# Altium schematic sheet MCU.SchDoc
size A3; SheetNumber: 4; SheetTotal: 13
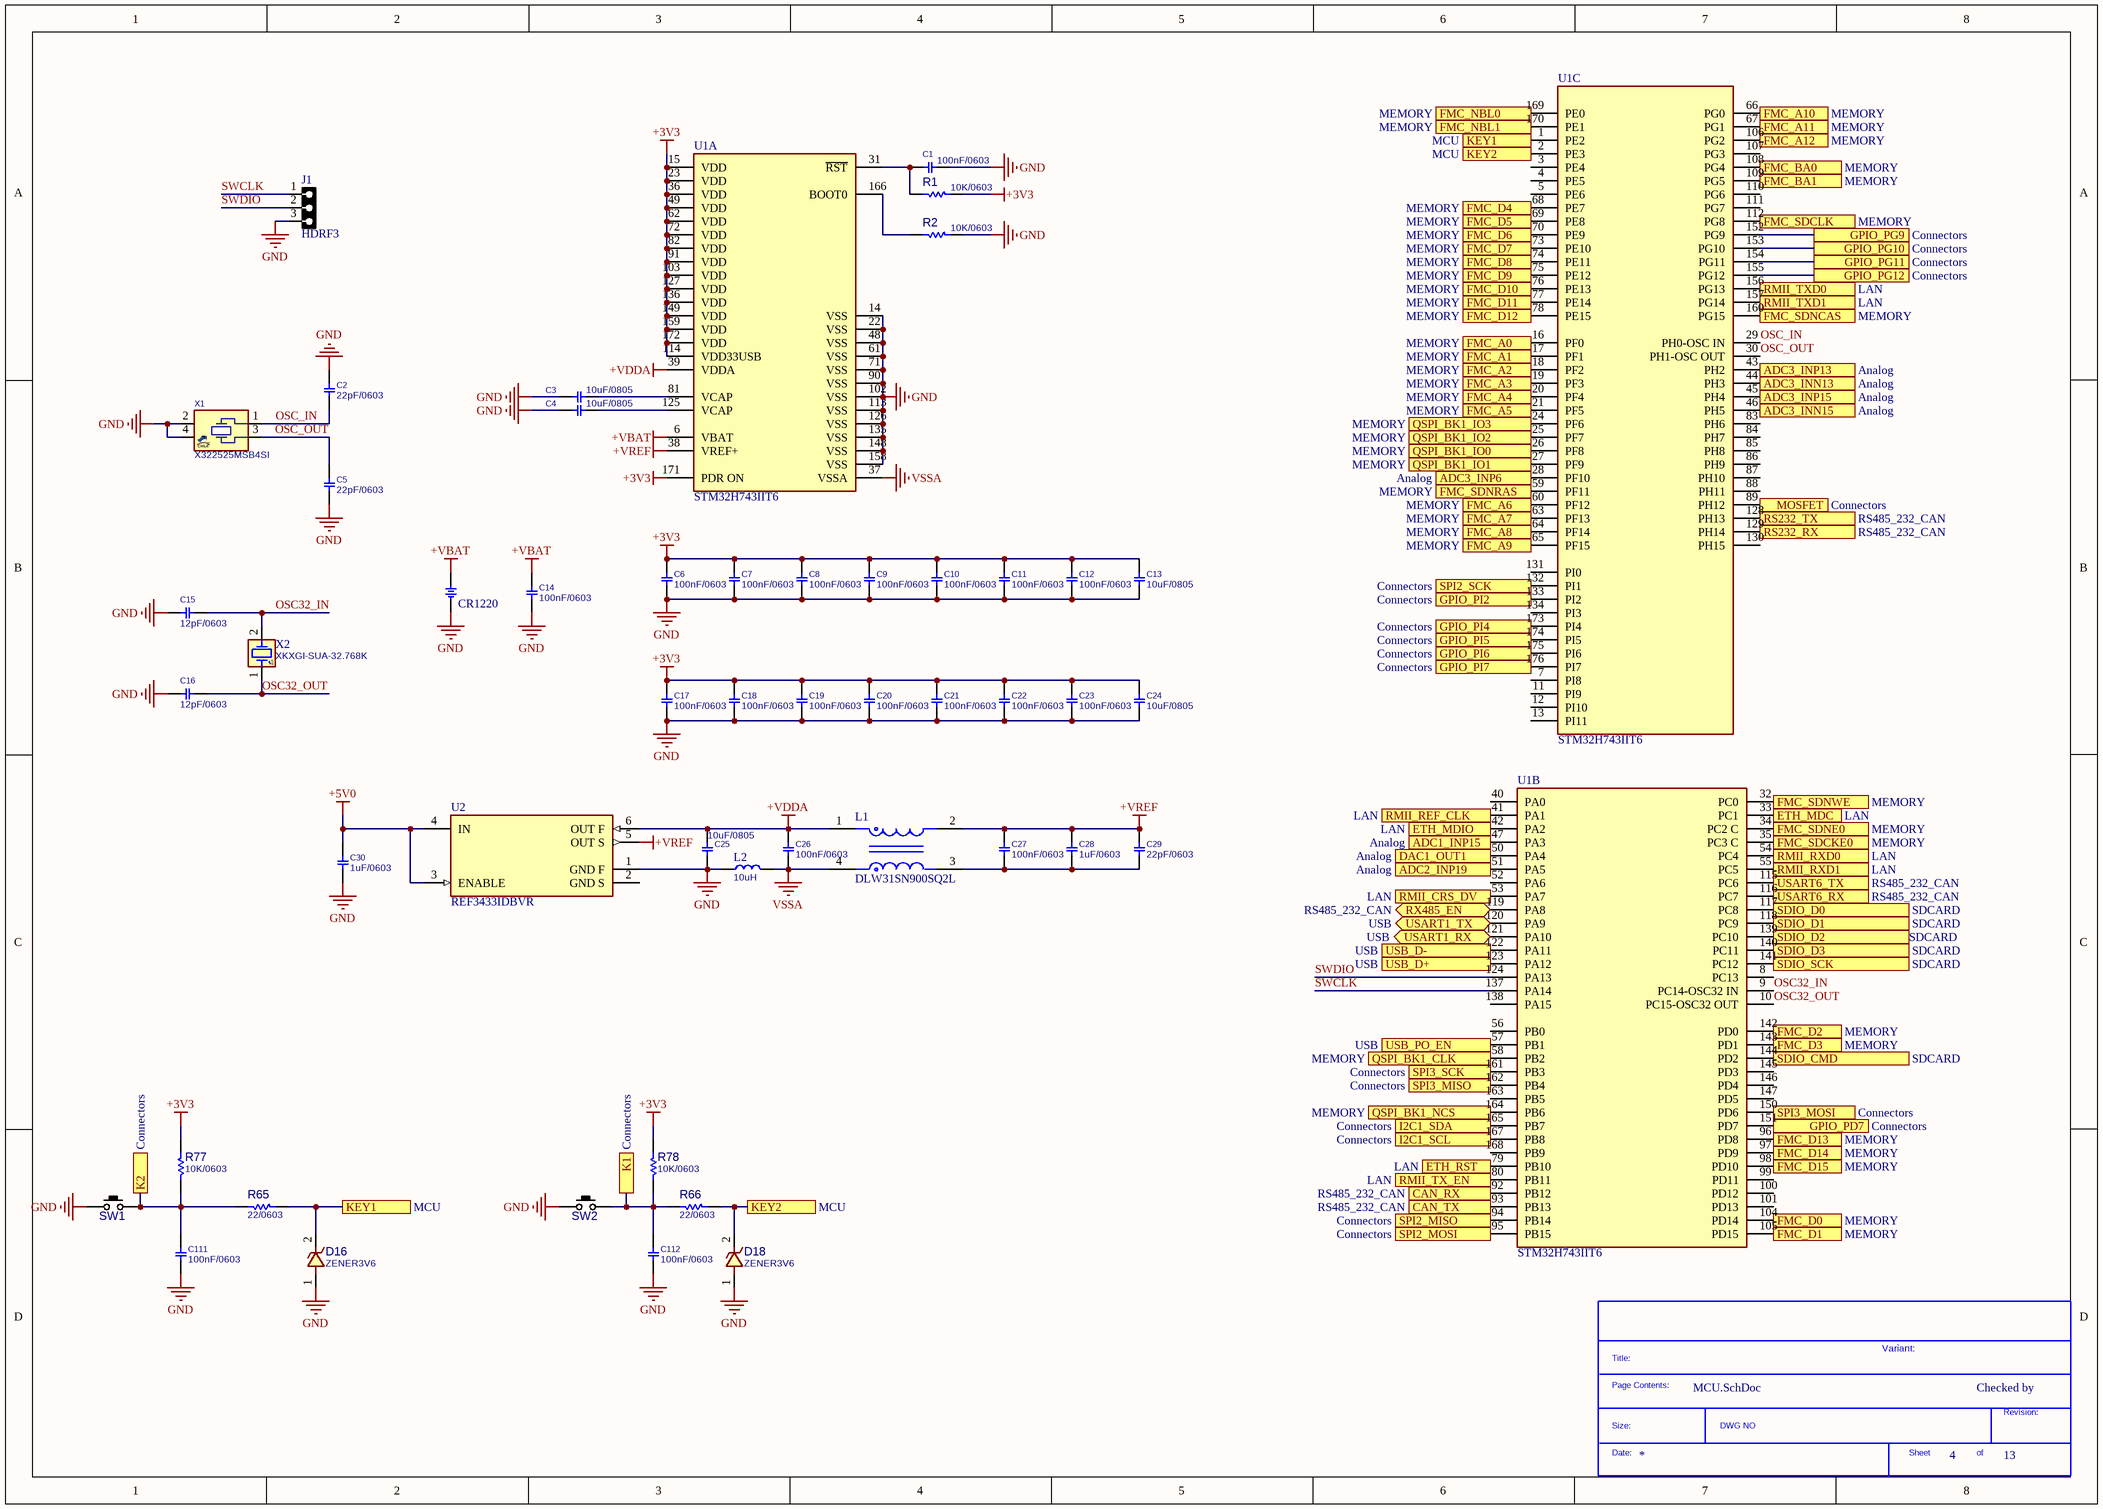
[diagram p0: MCU.SchDoc]

## Parts
?  (no value)  (graphical)
BT1  CR1220  [BTH1220]
C1  100nF/0603  [C0603]
C2  22pF/0603  [C0603]
C3  10uF/0805  [C0805]
C4  10uF/0805  [C0805]
C5  22pF/0603  [C0603]
C6  100nF/0603  [C0603]
C7  100nF/0603  [C0603]
C8  100nF/0603  [C0603]
C9  100nF/0603  [C0603]
C10  100nF/0603  [C0603]
C11  100nF/0603  [C0603]
C12  100nF/0603  [C0603]
C13  10uF/0805  [C0805]
C14  100nF/0603  [C0603]
C15  12pF/0603  [C0603]
C16  12pF/0603  [C0603]
C17  100nF/0603  [C0603]
C18  100nF/0603  [C0603]
C19  100nF/0603  [C0603]
C20  100nF/0603  [C0603]
C21  100nF/0603  [C0603]
C22  100nF/0603  [C0603]
C23  100nF/0603  [C0603]
C24  10uF/0805  [C0805]
C25  10uF/0805  [C0805]
C26  100nF/0603  [C0603]
C27  100nF/0603  [C0603]
C28  1uF/0603  [C0603]
C29  22pF/0603  [C0603]
C30  1uF/0603  [C0603]
C111  100nF/0603  [C0603]
C112  100nF/0603  [C0603]
D16  ZENER3V6  [D_SOD123W]
D18  ZENER3V6  [D_SOD123W]
J1  HDRF3  [HDR_F_1X3]
L1  DLW31SN900SQ2L  [FP-DLW31S-MFG]
L2  10uH  [L0805]
R1  10K/0603  [R0603]
R2  10K/0603  [R0603]
R65  22/0603  [R0603]
R66  22/0603  [R0603]
R77  10K/0603  [R0603]
R78  10K/0603  [R0603]
SW1  PUSHBUTTON  [SWPBS_SPST_6X3X5]  (value not drawn)
SW2  PUSHBUTTON  [SWPBS_SPST_6X3X5]  (value not drawn)
U1  STM32H743IIT6  [FP-LQFP176-1T-IPC_C]  (parts A,B,C of 3)
U2  REF3433IDBVR  [FP-DBV0006A-MFG]
X1  X322525MSB4SI  [XTL_4_3225]
X2  XKXGI-SUA-32.768K  [XTL_2_3215]

## Ports
ADC1_INP15 (see Analog), ADC2_INP19 (see Analog), ADC3_INN13 (see Analog), ADC3_INN15 (see Analog), ADC3_INP6 (see Analog), ADC3_INP13 (see Analog), ADC3_INP15 (see Analog), CAN_RX (see RS485_232_CAN), CAN_TX (see RS485_232_CAN), DAC1_OUT1 (see Analog), ETH_MDC (see LAN), ETH_MDIO (see LAN), ETH_RST (see LAN), FMC_A0 (see MEMORY), FMC_A1 (see MEMORY), FMC_A2 (see MEMORY), FMC_A3 (see MEMORY), FMC_A4 (see MEMORY), FMC_A5 (see MEMORY), FMC_A6 (see MEMORY), FMC_A7 (see MEMORY), FMC_A8 (see MEMORY), FMC_A9 (see MEMORY), FMC_A10 (see MEMORY), FMC_A11 (see MEMORY), FMC_A12 (see MEMORY), FMC_BA0 (see MEMORY), FMC_BA1 (see MEMORY), FMC_D0 (see MEMORY), FMC_D1 (see MEMORY), FMC_D2 (see MEMORY), FMC_D3 (see MEMORY), FMC_D4 (see MEMORY), FMC_D5 (see MEMORY), FMC_D6 (see MEMORY), FMC_D7 (see MEMORY), FMC_D8 (see MEMORY), FMC_D9 (see MEMORY), FMC_D10 (see MEMORY), FMC_D11 (see MEMORY), FMC_D12 (see MEMORY), FMC_D13 (see MEMORY), FMC_D14 (see MEMORY), FMC_D15 (see MEMORY), FMC_NBL0 (see MEMORY), FMC_NBL1 (see MEMORY), FMC_SDCKE0 (see MEMORY), FMC_SDCLK (see MEMORY), FMC_SDNCAS (see MEMORY), FMC_SDNE0 (see MEMORY), FMC_SDNRAS (see MEMORY), FMC_SDNWE (see MEMORY), GPIO_PD7 (see Connectors), GPIO_PG9 (see Connectors), GPIO_PG10 (see Connectors), GPIO_PG11 (see Connectors), GPIO_PG12 (see Connectors), GPIO_PI2 (see Connectors), GPIO_PI4 (see Connectors), GPIO_PI5 (see Connectors), GPIO_PI6 (see Connectors), GPIO_PI7 (see Connectors), I2C1_SCL (see Connectors), I2C1_SDA (see Connectors), K1 (see Connectors), K2 (see Connectors), KEY1 (see MCU), KEY2 (see MCU), MOSFET (see Connectors), QSPI_BK1_CLK (see MEMORY), QSPI_BK1_IO0 (see MEMORY), QSPI_BK1_IO1 (see MEMORY), QSPI_BK1_IO2 (see MEMORY), QSPI_BK1_IO3 (see MEMORY), QSPI_BK1_NCS (see MEMORY), RMII_CRS_DV (see LAN), RMII_REF_CLK (see LAN), RMII_RXD0 (see LAN), RMII_RXD1 (see LAN), RMII_TX_EN (see LAN), RMII_TXD0 (see LAN), RMII_TXD1 (see LAN), RS232_RX (see RS485_232_CAN), RS232_TX (see RS485_232_CAN), RX485_EN (bidir, see RS485_232_CAN), SDIO_CMD (see SDCARD), SDIO_D0 (see SDCARD), SDIO_D1 (see SDCARD), SDIO_D2 (see SDCARD), SDIO_D3 (see SDCARD), SDIO_SCK (see SDCARD), SPI2_MISO (see Connectors), SPI2_MOSI (see Connectors), SPI2_SCK (see Connectors), SPI3_MISO (see Connectors), SPI3_MOSI (see Connectors), SPI3_SCK (see Connectors), USART1_RX (bidir, see USB), USART1_TX (bidir, see USB), USART6_RX (see RS485_232_CAN), USART6_TX (see RS485_232_CAN), USB_D+ (see USB), USB_D- (see USB), USB_PO_EN (see USB)

## Nets
+3V3: C6.2 C7.2 C8.2 C9.2 C10.2 C11.2 C12.2 C13.2 C17.2 C18.2 C19.2 C20.2 C21.2 C22.2 C23.2 C24.2 R1.2 R77.2 R78.2 U1.15(VDD) U1.23(VDD) U1.36(VDD) U1.49(VDD) U1.62(VDD) U1.72(VDD) U1.82(VDD) U1.91(VDD) U1.103(VDD) U1.114(VDD33USB) U1.127(VDD) U1.136(VDD) U1.149(VDD) U1.159(VDD) U1.171(PDR_ON) U1.172(VDD)
+5V0: C30.2 U2.3(ENABLE) U2.4(IN)
+VBAT: BT1.1 C14.2 U1.6(VBAT)
+VDDA: C25.2 C26.2 L1.1 U1.39(VDDA) U2.6(OUT_F)
+VREF: C27.2 C28.2 C29.2 L1.2 U1.38(VREF+) U2.5(OUT_S)
GND: BT1.2 C1.1 C2.2 C3.1 C4.1 C5.1 C6.1 C7.1 C8.1 C9.1 C10.1 C11.1 C12.1 C13.1 C14.1 C15.2 C16.2 C17.1 C18.1 C19.1 C20.1 C21.1 C22.1 C23.1 C24.1 C25.1 C30.1 C111.1 C112.1 D16.1 D18.1 J1.3 L2.1 R2.2 SW1.1(P1) SW2.1(P1) U1.14(VSS) U1.22(VSS) U1.48(VSS) U1.61(VSS) U1.71(VSS) U1.90(VSS) U1.102(VSS) U1.113(VSS) U1.126(VSS) U1.135(VSS) U1.148(VSS) U1.158(VSS) U2.1(GND_F) X1.2 X1.4
VSSA: C26.1 L1.4 L2.2 U1.37(VSSA)
ADC1_INP15: U1.47(PA3) ; port ADC1_INP15
ADC2_INP19: U1.51(PA5) ; port ADC2_INP19
ADC3_INN13: U1.44(PH3) ; port ADC3_INN13
ADC3_INN15: U1.46(PH5) ; port ADC3_INN15
ADC3_INP6: U1.28(PF10) ; port ADC3_INP6
ADC3_INP13: U1.43(PH2) ; port ADC3_INP13
ADC3_INP15: U1.45(PH4) ; port ADC3_INP15
CAN_RX: U1.92(PB12) ; port CAN_RX
CAN_TX: U1.93(PB13) ; port CAN_TX
DAC1_OUT1: U1.50(PA4) ; port DAC1_OUT1
ETH_MDC: U1.33(PC1) ; port ETH_MDC
ETH_MDIO: U1.42(PA2) ; port ETH_MDIO
ETH_RST: U1.79(PB10) ; port ETH_RST
FMC_A0: U1.16(PF0) ; port FMC_A0
FMC_A1: U1.17(PF1) ; port FMC_A1
FMC_A2: U1.18(PF2) ; port FMC_A2
FMC_A3: U1.19(PF3) ; port FMC_A3
FMC_A4: U1.20(PF4) ; port FMC_A4
FMC_A5: U1.21(PF5) ; port FMC_A5
FMC_A6: U1.60(PF12) ; port FMC_A6
FMC_A7: U1.63(PF13) ; port FMC_A7
FMC_A8: U1.64(PF14) ; port FMC_A8
FMC_A9: U1.65(PF15) ; port FMC_A9
FMC_A10: U1.66(PG0) ; port FMC_A10
FMC_A11: U1.67(PG1) ; port FMC_A11
FMC_A12: U1.106(PG2) ; port FMC_A12
FMC_BA0: U1.108(PG4) ; port FMC_BA0
FMC_BA1: U1.109(PG5) ; port FMC_BA1
FMC_D0: U1.104(PD14) ; port FMC_D0
FMC_D1: U1.105(PD15) ; port FMC_D1
FMC_D2: U1.142(PD0) ; port FMC_D2
FMC_D3: U1.143(PD1) ; port FMC_D3
FMC_D4: U1.68(PE7) ; port FMC_D4
FMC_D5: U1.69(PE8) ; port FMC_D5
FMC_D6: U1.70(PE9) ; port FMC_D6
FMC_D7: U1.73(PE10) ; port FMC_D7
FMC_D8: U1.74(PE11) ; port FMC_D8
FMC_D9: U1.75(PE12) ; port FMC_D9
FMC_D10: U1.76(PE13) ; port FMC_D10
FMC_D11: U1.77(PE14) ; port FMC_D11
FMC_D12: U1.78(PE15) ; port FMC_D12
FMC_D13: U1.96(PD8) ; port FMC_D13
FMC_D14: U1.97(PD9) ; port FMC_D14
FMC_D15: U1.98(PD10) ; port FMC_D15
FMC_NBL0: U1.169(PE0) ; port FMC_NBL0
FMC_NBL1: U1.170(PE1) ; port FMC_NBL1
FMC_SDCKE0: U1.35(PC3_C) ; port FMC_SDCKE0
FMC_SDCLK: U1.112(PG8) ; port FMC_SDCLK
FMC_SDNCAS: U1.160(PG15) ; port FMC_SDNCAS
FMC_SDNE0: U1.34(PC2_C) ; port FMC_SDNE0
FMC_SDNRAS: U1.59(PF11) ; port FMC_SDNRAS
FMC_SDNWE: U1.32(PC0) ; port FMC_SDNWE
GPIO_PD7: U1.151(PD7) ; port GPIO_PD7
GPIO_PG9: U1.152(PG9) ; port GPIO_PG9
GPIO_PG10: U1.153(PG10) ; port GPIO_PG10
GPIO_PG11: U1.154(PG11) ; port GPIO_PG11
GPIO_PG12: U1.155(PG12) ; port GPIO_PG12
GPIO_PI2: U1.133(PI2) ; port GPIO_PI2
GPIO_PI4: U1.173(PI4) ; port GPIO_PI4
GPIO_PI5: U1.174(PI5) ; port GPIO_PI5
GPIO_PI6: U1.175(PI6) ; port GPIO_PI6
GPIO_PI7: U1.176(PI7) ; port GPIO_PI7
I2C1_SCL: U1.167(PB8) ; port I2C1_SCL
I2C1_SDA: U1.165(PB7) ; port I2C1_SDA
K1: C112.2 R66.2 R78.1 SW2.2(P3) ; port K1
K2: C111.2 R65.2 R77.1 SW1.2(P3) ; port K2
KEY1: D16.2 R65.1 U1.1(PE2) ; port KEY1
KEY2: D18.2 R66.1 U1.2(PE3) ; port KEY2
MOSFET: U1.89(PH12) ; port MOSFET
OSC32_IN: C15.1 U1.9(PC14-OSC32_IN) X2.2(OSC2)
OSC32_OUT: C16.1 U1.10(PC15-OSC32_OUT) X2.1(OSC1)
OSC_IN: C2.1 U1.29(PH0-OSC_IN) X1.1
OSC_OUT: C5.2 U1.30(PH1-OSC_OUT) X1.3
QSPI_BK1_CLK: U1.58(PB2) ; port QSPI_BK1_CLK
QSPI_BK1_IO0: U1.26(PF8) ; port QSPI_BK1_IO0
QSPI_BK1_IO1: U1.27(PF9) ; port QSPI_BK1_IO1
QSPI_BK1_IO2: U1.25(PF7) ; port QSPI_BK1_IO2
QSPI_BK1_IO3: U1.24(PF6) ; port QSPI_BK1_IO3
QSPI_BK1_NCS: U1.164(PB6) ; port QSPI_BK1_NCS
RMII_CRS_DV: U1.53(PA7) ; port RMII_CRS_DV
RMII_REF_CLK: U1.41(PA1) ; port RMII_REF_CLK
RMII_RXD0: U1.54(PC4) ; port RMII_RXD0
RMII_RXD1: U1.55(PC5) ; port RMII_RXD1
RMII_TX_EN: U1.80(PB11) ; port RMII_TX_EN
RMII_TXD0: U1.156(PG13) ; port RMII_TXD0
RMII_TXD1: U1.157(PG14) ; port RMII_TXD1
RS232_RX: U1.129(PH14) ; port RS232_RX
RS232_TX: U1.128(PH13) ; port RS232_TX
RX485_EN: U1.119(PA8) ; port RX485_EN
SDIO_CMD: U1.144(PD2) ; port SDIO_CMD
SDIO_D0: U1.117(PC8) ; port SDIO_D0
SDIO_D1: U1.118(PC9) ; port SDIO_D1
SDIO_D2: U1.139(PC10) ; port SDIO_D2
SDIO_D3: U1.140(PC11) ; port SDIO_D3
SDIO_SCK: U1.141(PC12) ; port SDIO_SCK
SPI2_MISO: U1.94(PB14) ; port SPI2_MISO
SPI2_MOSI: U1.95(PB15) ; port SPI2_MOSI
SPI2_SCK: U1.132(PI1) ; port SPI2_SCK
SPI3_MISO: U1.162(PB4) ; port SPI3_MISO
SPI3_MOSI: U1.150(PD6) ; port SPI3_MOSI
SPI3_SCK: U1.161(PB3) ; port SPI3_SCK
SWCLK: J1.1 U1.137(PA14)
SWDIO: J1.2 U1.124(PA13)
USART1_RX: U1.121(PA10) ; port USART1_RX
USART1_TX: U1.120(PA9) ; port USART1_TX
USART6_RX: U1.116(PC7) ; port USART6_RX
USART6_TX: U1.115(PC6) ; port USART6_TX
USB_D+: U1.123(PA12) ; port USB_D+
USB_D-: U1.122(PA11) ; port USB_D-
USB_PO_EN: U1.57(PB1) ; port USB_PO_EN
NetC1_2: C1.2 R1.1 U1.31(~{RST})
NetC3_2: C3.2 U1.81(VCAP)
NetC4_2: C4.2 U1.125(VCAP)
NetC27_1: C27.1 C28.1 C29.1 L1.3
NetR2_1: R2.1 U1.166(BOOT0)

Not connected (* = marked no-connect by the designer): U1 3(PE4) 4(PE5) 5(PE6) 7(PI8) 8(PC13) 11(PI9) 12(PI10) 13(PI11) 40(PA0) 52(PA6) 56(PB0) 83(PH6) 84(PH7) 85(PH8) 86(PH9) 87(PH10) 88(PH11) 99(PD11) 100(PD12) 101(PD13) 107(PG3) 110(PG6) 111(PG7) 130(PH15) 131(PI0) 134(PI3) 138(PA15) 145(PD3) 146(PD4) 147(PD5) 163(PB5) 168(PB9); U2 2(GND_S)

## Notes on the sheet
- Title:
- Page Contents:
- Variant:
- Checked by
- Size:
- Date:
- DWG NO
- Sheet
- of
- Revision:

## Library data of the parts
? = SDTitleBlock
BT1 = BATH_CR1220: BATTERY HOLDER, CR1220; MANF_P#: -; .: http://www.chila.ir; VALUE: CR1220
C1 C2 C5-C12 C14-C23 C26-C30 C111 C112 = CAP_SMD_MLCC_0603: CAP, MLCC; PARAM: -, -%; MANF_P#: MANF_PART#; PARAM2: -V; PRICE: 100= 1$; MANF: -; ASSEMBLY: ASSEMBLY
  C1 C6-C12 C14 C17-C23 C26 C27 C111 C112: VALUE: 100nF/0603
  C2 C5 C29: VALUE: 22pF/0603
  C15 C16: VALUE: 12pF/0603
  C28 C30: VALUE: 1uF/0603
C3 C4 C13 C24 C25 = CAP_SMD_MLCC: CAP, MLCC; PARAM: C0G, 10%; DESC: CAP, MLCC, 1nF, 50V, C0G, 10%, 0402; MANF_P#: MANF_PART#; MANF: Murata; PARAM2: 50V; PRICE: 100= 1$; ASSEMBLY: ASSEMBLY; VALUE: 10uF/0805
D16 D18 = DIODE_SMD_ZENER_DFLZ5V6: DIODE, ZENER, 1W, 5.1V; MANF: Diodes; DESC: DESCRIPTION; PARAM2: 1W, 4Ohm, -55~150oC; PARAM: 5.6V; MANF_P#: DFLZ5V6-7; ASSEMBLY: ASSEMBLY; PRICE: 0.5$; VALUE: ZENER3V6
J1 = HDR_F_1X3: CONN, HEADER, Female, pitch: 2.54mm, 3POS; VALUE: HDRF3
L1 = CMP-06045-000166-1: CMC 370MA 2LN 90 OHM SMD; Frequency: 100MHz; DC Resistance (DCR): 300mR; Tolerance: 25%; Shielding: Unshielded; Impedance: 90R; Voltage Rating: 50V; Number of Lines: 2; Weight: 0.001376oz; Case/Package: 1206; Width: 0.063inch; Case Code (Imperial): 1206; Max Operating Temperature: 85°C; Lead Free: Lead Free; Max DC Current: 370mA; DC Current: 370mA; Military Standard: Not; Package Quantity: 1; Radiation Hardening: No; Packaging: Tape and Reel; Depth: 1.6mm; Height: 1.9mm; Termination: SMD/SMT; Current: 370mA; Length: 3.2mm; Current Rating: 370mA; Resistor Type: Wirewound; Mount: Surface Mount; Min Operating Temperature: -40°C; Test Frequency: 100MHz
L2 = IND_SMD: INDUCTOR, SMD; VALUE: 10uH
R1 R2 R65 R66 R77 R78 = RES_SMD_0603: RESISTOR, SMD; PARAM: 1%, 0.1W; DESC: DESCRIPTION; DIST#: MOUSER; MANF_P#: -; MANF: -; ASSEMBLY: ASSEMBLY; PRICE: -; PARAM2: -
  R1 R2 R77 R78: VALUE: 10K/0603
  R65 R66: VALUE: 22/0603
SW1 SW2 = SWPBS_SPST_6X3X4: SWITCH, PUSH BUTTON, TACTILE, SMD, SPST, 6X3.5X4.3mm; MANF: Panasonic; DESC: DESCRIPTION; MANF_P#: EVQ-PNF04M; VALUE: PUSHBUTTON; ASSEMBLY: ASSEMBLY; PARAM: PARAM; PRICE: PRICE
U1 = CMP-12105-000078-1: IC MCU 32BIT 2MB FLASH 176LQFP; Manufacturer: STMicroelectronics; Number Of I/Os: 140; Number Of Pwm Channels: 2; Standoff Height: 0.05mm; Number Of Uart Channels: 9; Frequency: 400MHz; Core Architecture: ARM Cortex-M7; Ram Size: 1MBytes; Max Supply Voltage: 3.6V; Number Of Timers/Counters: 20; Min Supply Voltage: 1.62V; Number Of I2C Channels: 4; Number Of Cores: 1; Max Junction Temp: +125°C; Data Bus Width: 32bits; Memory Size: 2MBytes; Number Of Adc Channels: 36; Number Of Spi Channels: 6; Interface: I2C,SPI,UART,USART,CAN,USB,LIN,IrDA,Ethernet,SMBus,Other; Number Of A/D Converters: 3; Digikey Description: IC MCU 32BIT 2MB FLASH 176LQFP; Temperature: -40°C to +125°C; Package: LQFP176-1T; RoHS: TRUE; Memory Type: FLASH; Device Class L3: Microcontrollers; Manufacturer Part Number: STM32H743IIT6; Mouser Description: MCU 32-Bit STM32 ARM Cortex M7 RISC 2MB Flash 1.8V/2.5V/3.3V 176-Pin LQFP Tray; Category: IC; Automotive: No; Ambient Temperature Range High: +85°C; Number Of Usb Channels: 2; ComponentLink2URL: https://www.st.com/resource/en/datasheet/stm32h743ii.pdf; Lead Free: Yes; Ambient Temperature Range Low: -40°C; ComponentLink2Description: Datasheet; Device Class L2: Embedded Processors and Controllers; Octopart: https://octopart.com/stm32h743iit6-stmicroelectronics-76372526; Device Class L1: Integrated Circuits (ICs); Height: 1.6mm; Temperature Range Low: -40°C; Temperature Range High: +125°C; Number Of Ethernet Channels: 1; Ipc Land Pattern Name: QFP50P2600X2600X160-176
U2 = CMP-04916-000020-1: IC VREF SERIES 0.05% SOT23-6; Output Current: 10mA; Min Output Voltage: 3.3V; Operating Supply Current: 95uA; Output Type: Fixed; Temperature Coefficient: 6ppm/°C; Mount: Surface Mount; Tolerance: 0.05%; Packaging: Tape and Reel; Min Operating Temperature: -40°C; Max Operating Temperature: 125°C; Reference Type: Series; Case/Package: SOT-23-6
X1 = XTL_4_24MHz_3225A: Crystal 24MHz; MANF: ABRACON; MANF_P#: ABM8W-24.0000MHZ-4-D1X-T3; PARAM2: 10PPM, 4pF; PARAM: -40~85oC; PRICE: 0.7$; VALUE: X322525MSB4SI
X2 = XTL_2_32.768_3215C: Crystal, 32.768KHz, 5pF, 20PPM; MANF: CTS; MANF_P#: TFE322T32K7680R; PARAM: -40~85oC; PARAM2: 5pF, 20PPM; PRICE: 0.9$; VALUE: XKXGI-SUA-32.768K